# Altium schematic sheet QUTMS-ElectricalSystem.SchDoc: ####
size A0; DrawnBy: M. Broadmeadow; Organization: Queensland University of Technology; Address1: Gardens Point Campus; Address2: 2 George Street; Address3: Brisbane, QLD 4000; Address4: Australia; DocumentNumber: ####-B01; Revision: 00; SheetNumber: 1; SheetTotal: 1; Version: 00; Project: ####; PageSetup: Record=PageOptions|CenterHorizontal=True|CenterVertical=True|PrintScale=0.97|XCorrection=1.00|YCorrection=1.00|PrintKind=0|BorderSize=5000000|LeftOffset=0|BottomOffset=0|Orientation=2|PaperLength=1000|PaperWidth=1000|Scale=100|PaperSource=7|PrintQuality=-4|MediaType=1|DitherType=10|PaperKind=A4|PrintScaleMode=1
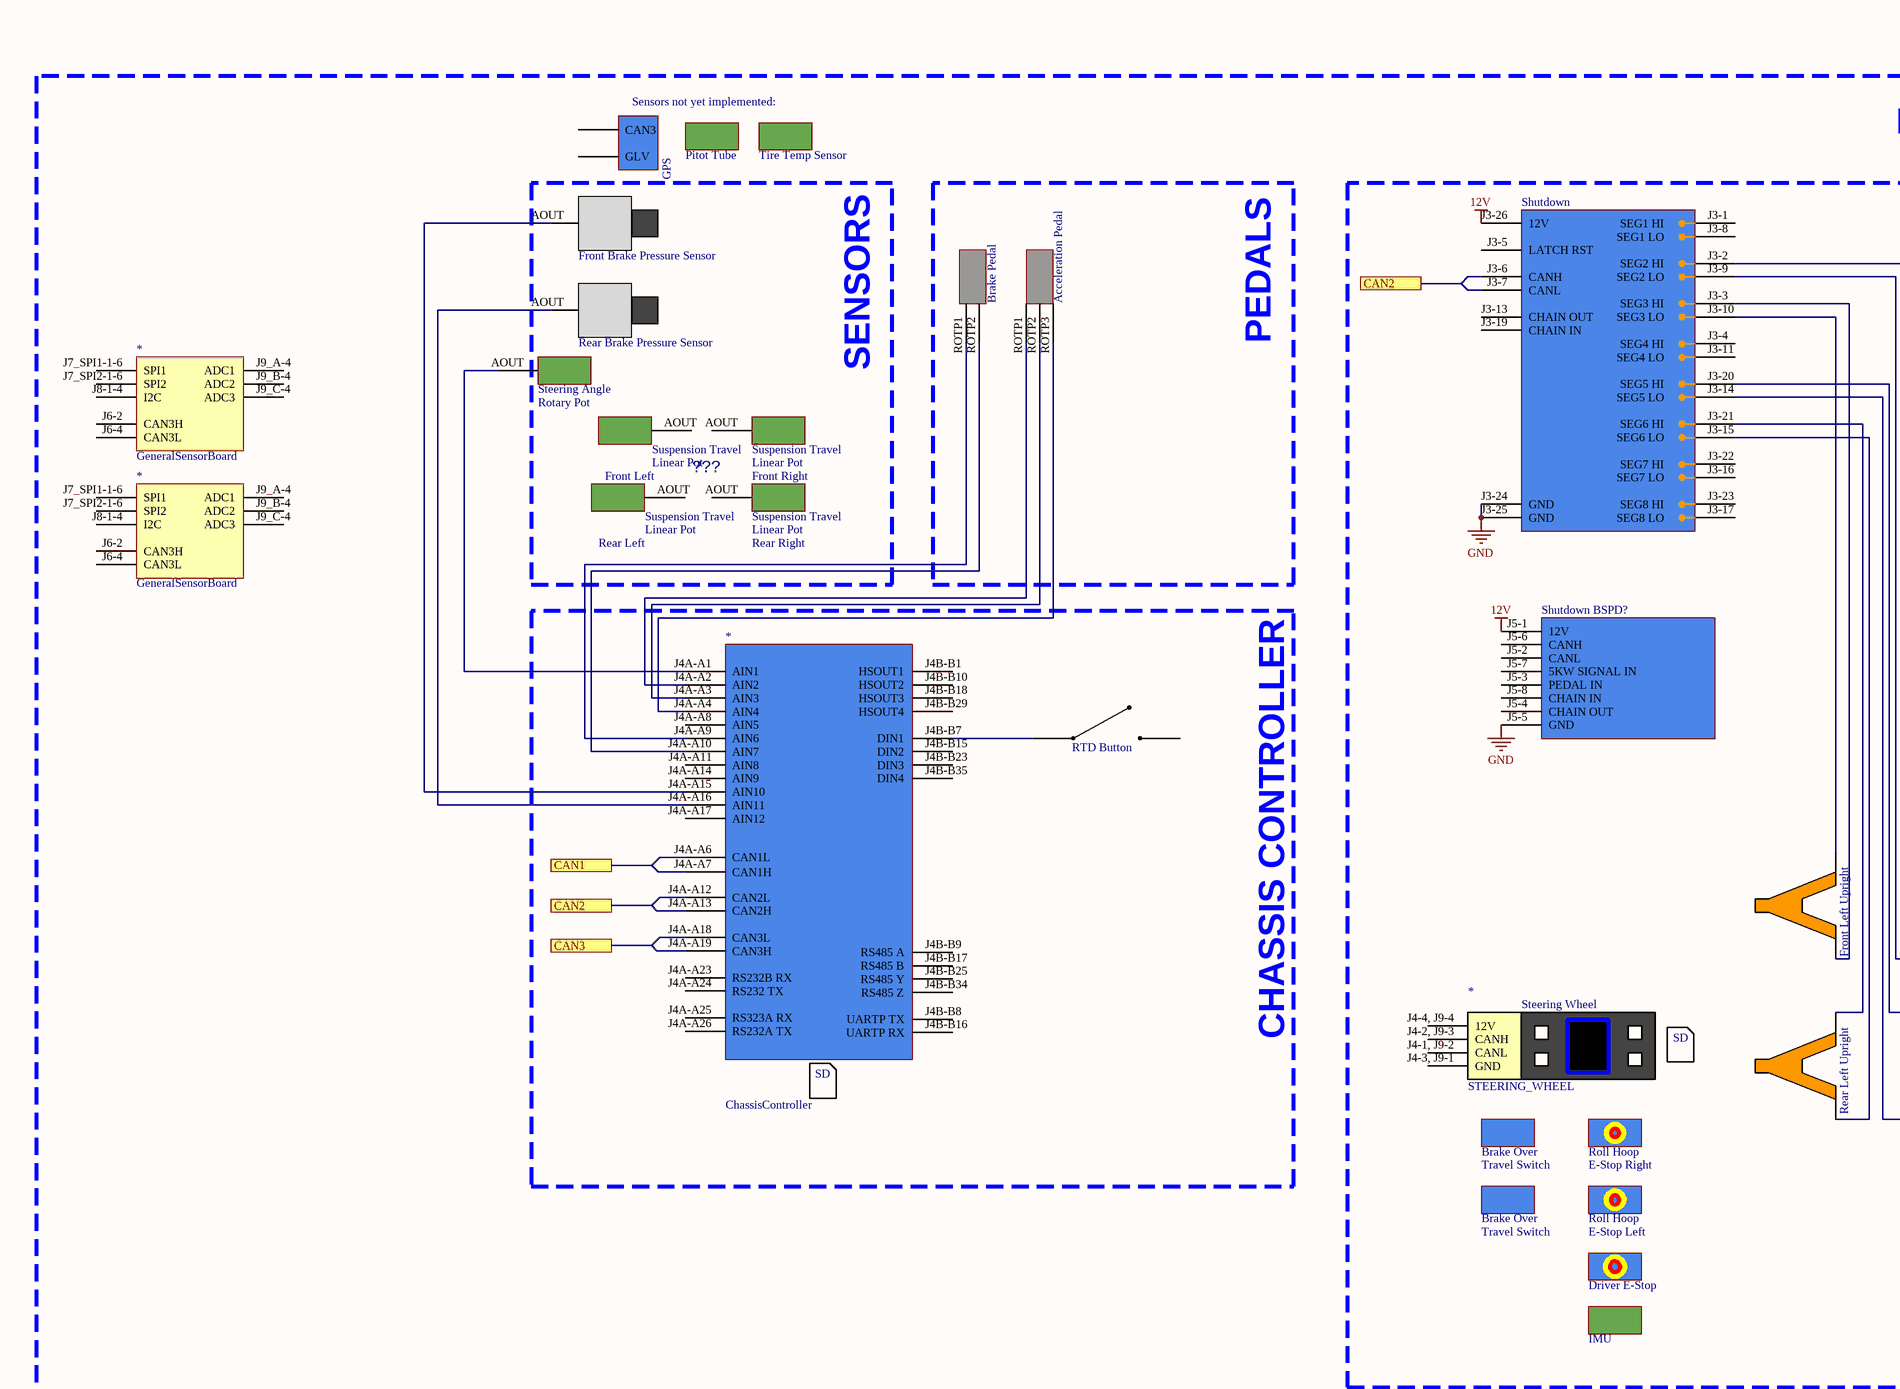
[diagram p0: QUTMS-ElectricalSystem.SchDoc, top left]
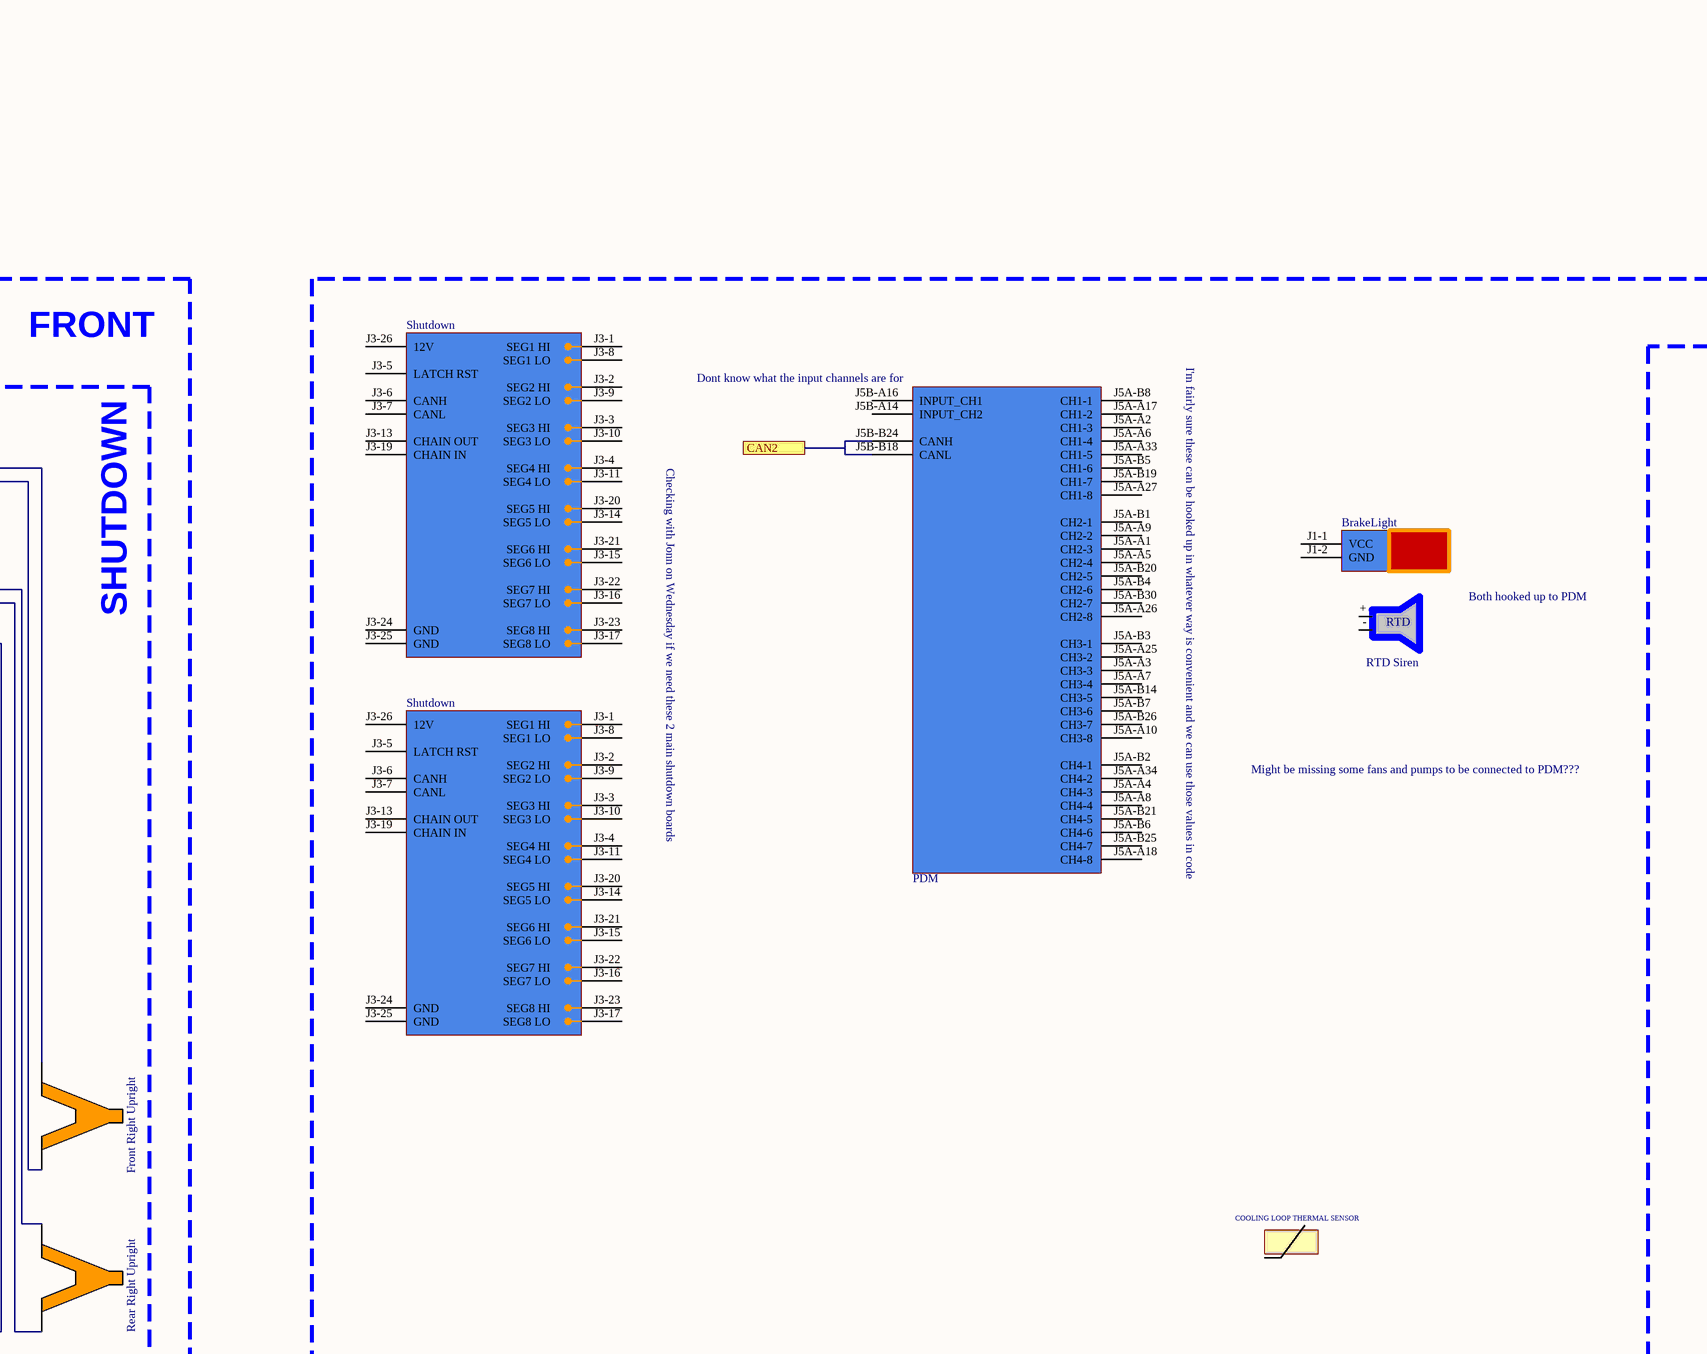
[diagram p1: QUTMS-ElectricalSystem.SchDoc, top middle]
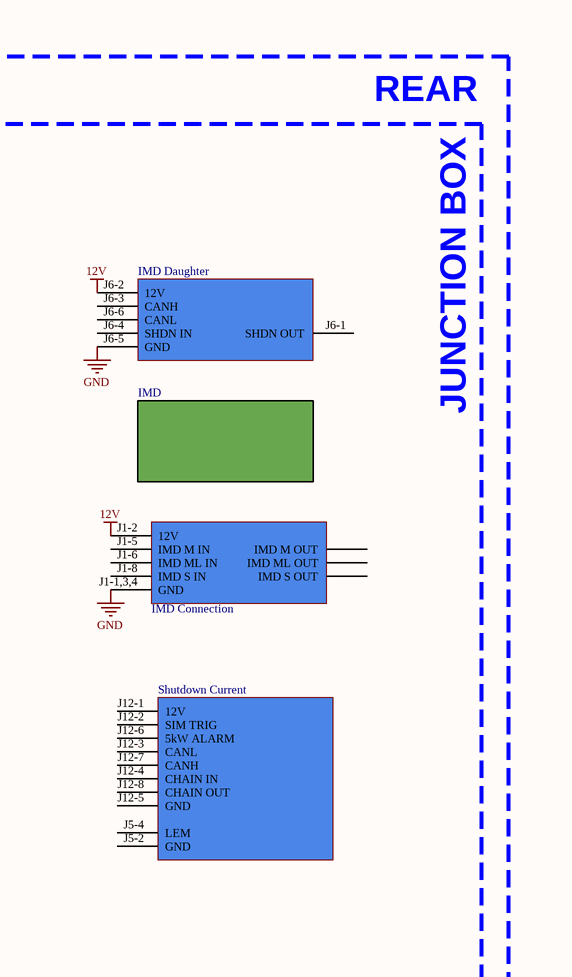
[diagram p2: QUTMS-ElectricalSystem.SchDoc, top right]
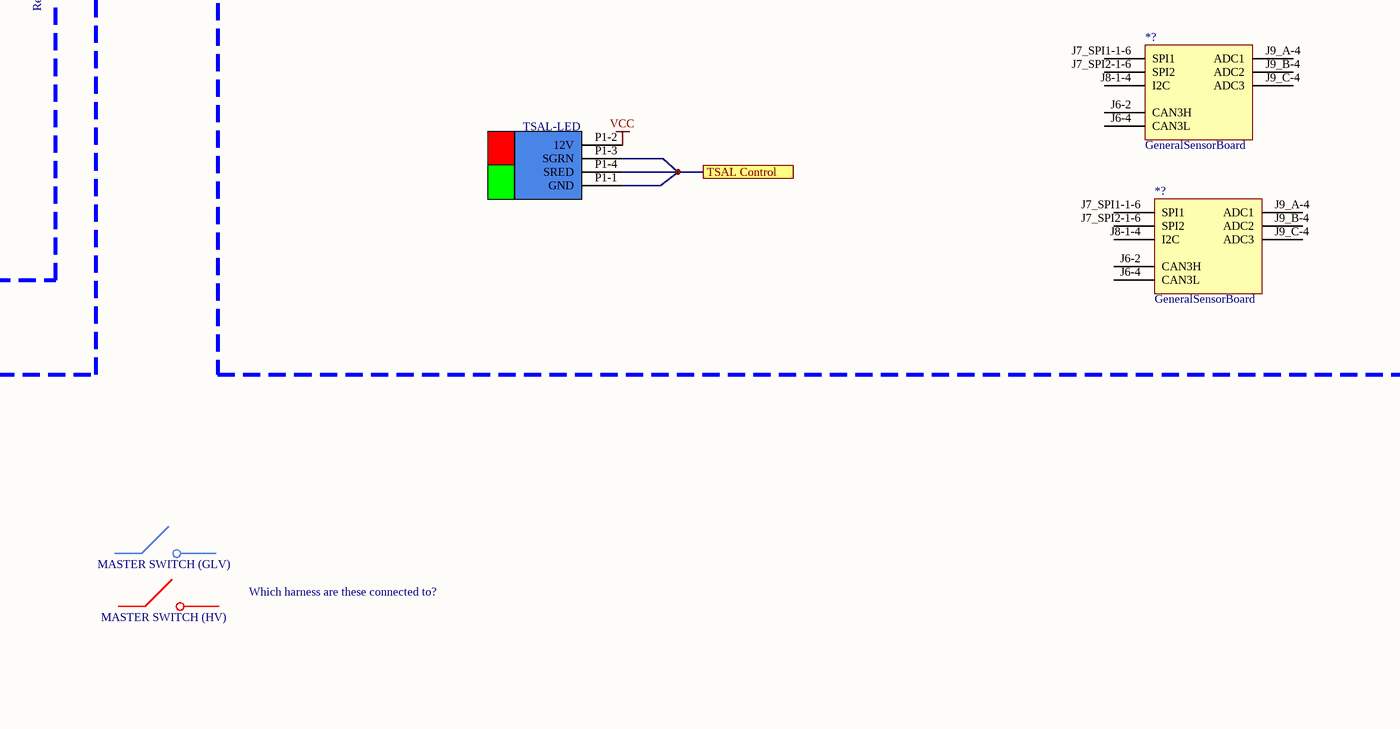
[diagram p3: QUTMS-ElectricalSystem.SchDoc, centre middle]
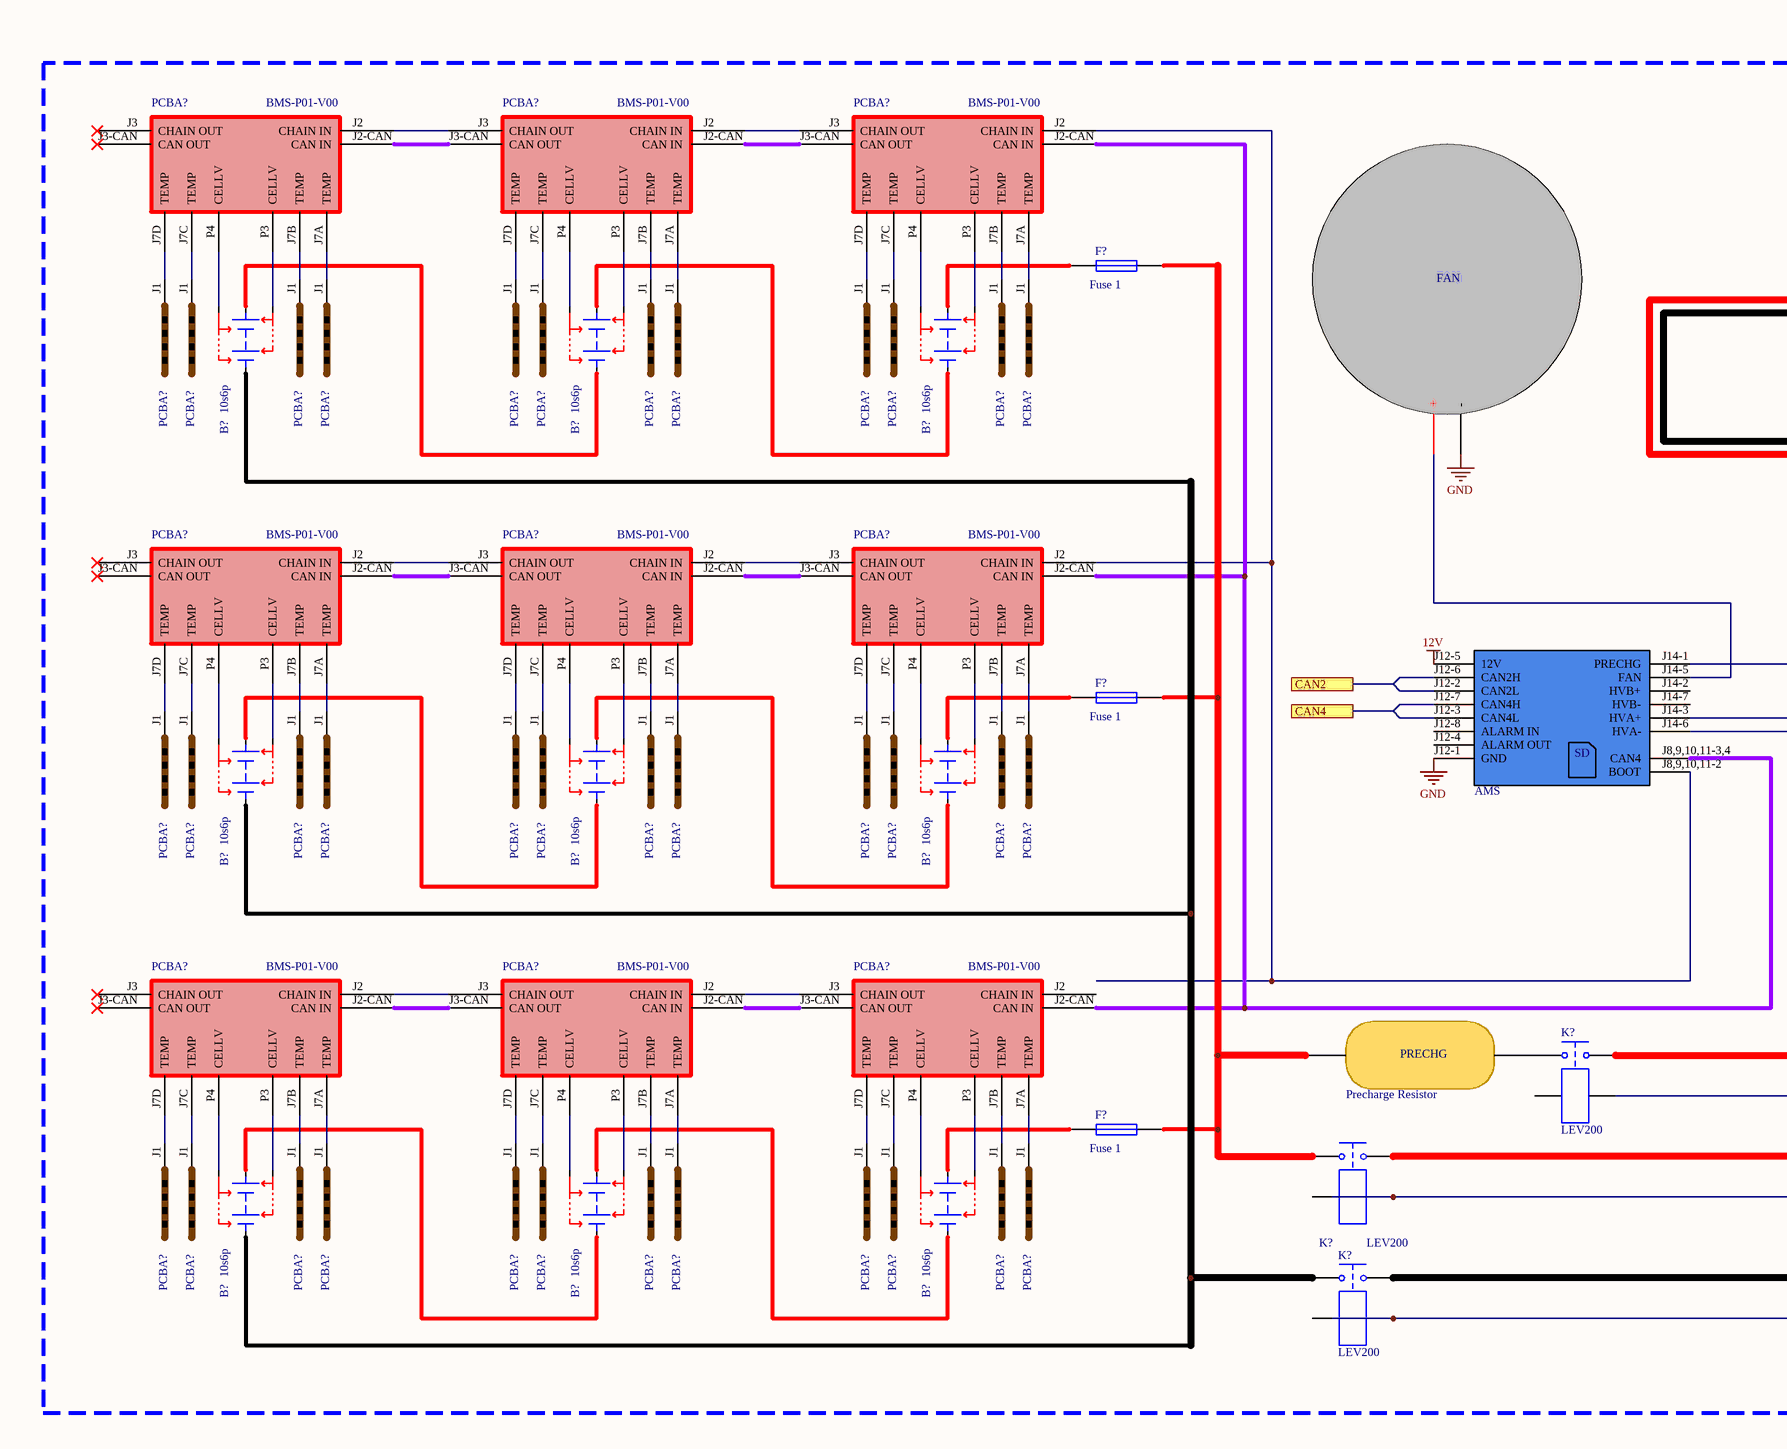
[diagram p4: QUTMS-ElectricalSystem.SchDoc, bottom middle]
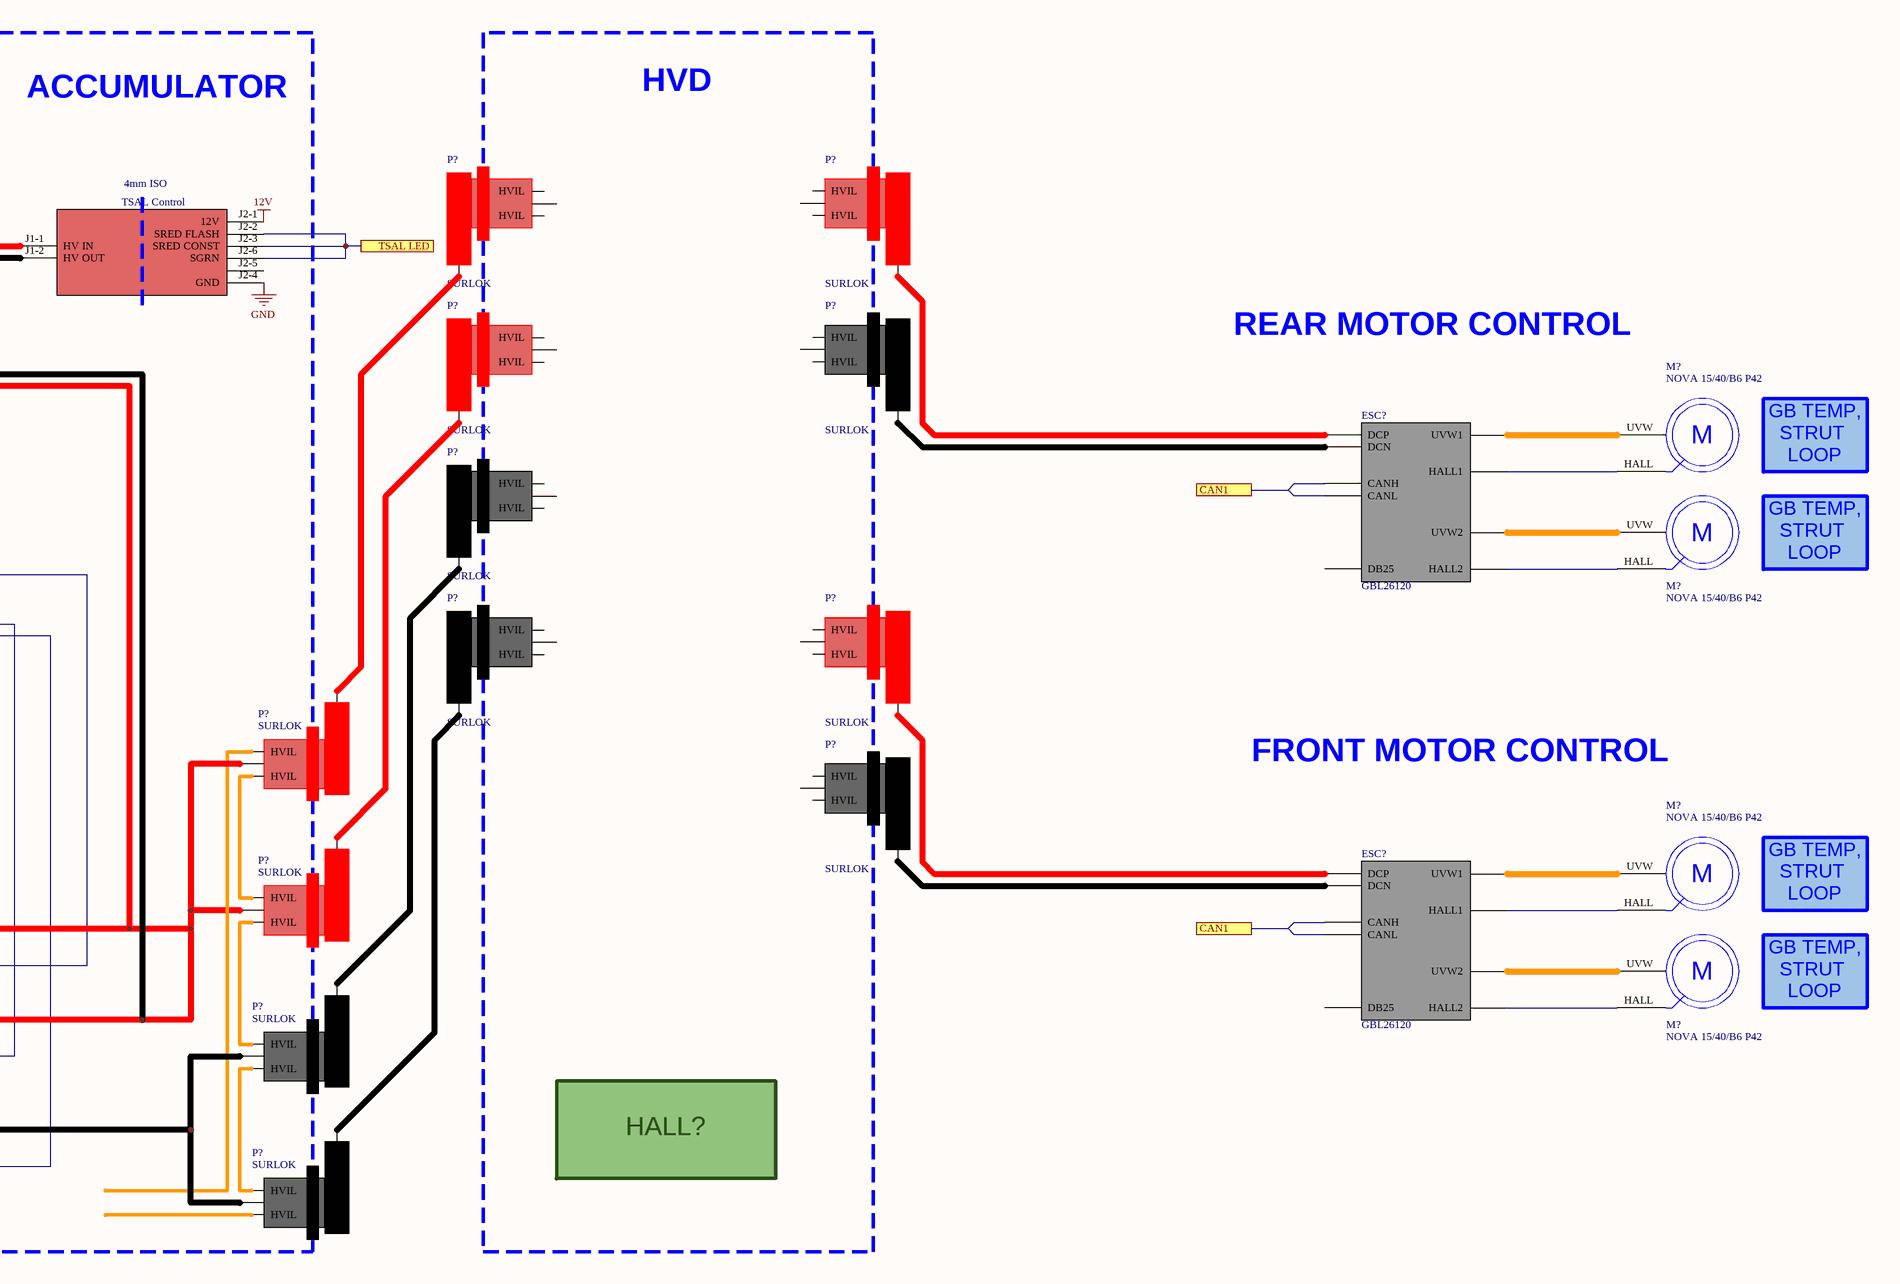
[diagram p5: QUTMS-ElectricalSystem.SchDoc, bottom right]

## Parts
(Parts that share a designator on the sheet are numbered #1, #2 ... from top to bottom, then left to right.)
*#1  Front Brake Pressure Sensor
*#2  GeneralSensorBoard
*#3  Rear Brake Pressure Sensor
*#4  GeneralSensorBoard
*#5  PDM
*#6  ChassisController
*#7  STEERING_WHEEL
*#8  RollHoopRightE-Stop  (value not drawn)
*#9  RollHoopLeftE-Stop  (value not drawn)
*#10  Driver E-Stop  (value not drawn)
*#11  Inertial Measurement Unit  (value not drawn)
*#12  Precharge Resistor
*?#1  Pitot Tube  (value not drawn)
*?#2  Tire Temperature Sensor  (value not drawn)
*?#3  GPS  (value not drawn)
*?#4  BrakePedal  (value not drawn)
*?#5  AccelerationPedal  (value not drawn)
*?#6  Steering Angle - Rotary Pot  (value not drawn)
*?#7  BrakeLight
*?#8  Front Left
*?#9  Front Right
*?#10  RTD Siren
*?#11  IMD Daughter  (value not drawn)
*?#12  Rear Left
*?#13  Rear Right
*?#14  IMD
*?#15  RTD Button
*?#16  Front Right Upright
*?#17  Front Left Upright
*?#18  Rear Right Upright
*?#19  COOLING LOOP THERMAL SENSOR  (value not drawn)
*?#20  Rear Left Upright
*?#21  BrakeOverTravelSwitch  (value not drawn)
*?#22  BrakeOverTravelSwitch  (value not drawn)
*?#23  GeneralSensorBoard
*?#24  TSAL-LED  (value not drawn)
*?#25  GeneralSensorBoard
*?#26  Master Switch (GLV)  (value not drawn)
*?#27  Master Switch HV  (value not drawn)
*?#28  TSAL_CONTROL  (value not drawn)
*?#29  AMS
?  (no value)
B?#1  10s6p
B?#2  10s6p
B?#3  10s6p
B?#4  10s6p
B?#5  10s6p
B?#6  10s6p
B?#7  10s6p
B?#8  10s6p
B?#9  10s6p
ESC?#1  GBL26120
ESC?#2  GBL26120
F?#1  Fuse 1  [PIN-W2/E2.8]
F?#2  Fuse 1  [PIN-W2/E2.8]
F?#3  Fuse 1  [PIN-W2/E2.8]
IMD_Connection?  (no value)
K?#1  LEV200
K?#2  LEV200
K?#3  LEV200
M?#1  NOVA 15/40/B6 P42
M?#2  NOVA 15/40/B6 P42
M?#3  NOVA 15/40/B6 P42
M?#4  NOVA 15/40/B6 P42
P?#1  SURLOK
P?#2  SURLOK
P?#3  SURLOK
P?#4  SURLOK
P?#5  SURLOK
P?#6  SURLOK
P?#7  SURLOK
P?#8  SURLOK
P?#9  SURLOK
P?#10  SURLOK
P?#11  SURLOK
P?#12  SURLOK
PCBA?#1  BMS-P01-V00
PCBA?#2  BMS-P01-V00
PCBA?#3  BMS-P01-V00
PCBA?#4  TEMPSTRIP-LEFT-V00  (value not drawn)
PCBA?#5  TEMPSTRIP-LEFT-V00  (value not drawn)
PCBA?#6  TEMPSTRIP-LEFT-V00  (value not drawn)
PCBA?#7  TEMPSTRIP-LEFT-V00  (value not drawn)
PCBA?#8  TEMPSTRIP-LEFT-V00  (value not drawn)
PCBA?#9  TEMPSTRIP-LEFT-V00  (value not drawn)
PCBA?#10  TEMPSTRIP-LEFT-V00  (value not drawn)
PCBA?#11  TEMPSTRIP-LEFT-V00  (value not drawn)
PCBA?#12  TEMPSTRIP-LEFT-V00  (value not drawn)
PCBA?#13  TEMPSTRIP-LEFT-V00  (value not drawn)
PCBA?#14  TEMPSTRIP-LEFT-V00  (value not drawn)
PCBA?#15  TEMPSTRIP-LEFT-V00  (value not drawn)
PCBA?#16  BMS-P01-V00
PCBA?#17  BMS-P01-V00
PCBA?#18  BMS-P01-V00
PCBA?#19  TEMPSTRIP-LEFT-V00  (value not drawn)
PCBA?#20  TEMPSTRIP-LEFT-V00  (value not drawn)
PCBA?#21  TEMPSTRIP-LEFT-V00  (value not drawn)
PCBA?#22  TEMPSTRIP-LEFT-V00  (value not drawn)
PCBA?#23  TEMPSTRIP-LEFT-V00  (value not drawn)
PCBA?#24  TEMPSTRIP-LEFT-V00  (value not drawn)
PCBA?#25  TEMPSTRIP-LEFT-V00  (value not drawn)
PCBA?#26  TEMPSTRIP-LEFT-V00  (value not drawn)
PCBA?#27  TEMPSTRIP-LEFT-V00  (value not drawn)
PCBA?#28  TEMPSTRIP-LEFT-V00  (value not drawn)
PCBA?#29  TEMPSTRIP-LEFT-V00  (value not drawn)
PCBA?#30  TEMPSTRIP-LEFT-V00  (value not drawn)
PCBA?#31  BMS-P01-V00
PCBA?#32  BMS-P01-V00
PCBA?#33  BMS-P01-V00
PCBA?#34  TEMPSTRIP-LEFT-V00  (value not drawn)
PCBA?#35  TEMPSTRIP-LEFT-V00  (value not drawn)
PCBA?#36  TEMPSTRIP-LEFT-V00  (value not drawn)
PCBA?#37  TEMPSTRIP-LEFT-V00  (value not drawn)
PCBA?#38  TEMPSTRIP-LEFT-V00  (value not drawn)
PCBA?#39  TEMPSTRIP-LEFT-V00  (value not drawn)
PCBA?#40  TEMPSTRIP-LEFT-V00  (value not drawn)
PCBA?#41  TEMPSTRIP-LEFT-V00  (value not drawn)
PCBA?#42  TEMPSTRIP-LEFT-V00  (value not drawn)
PCBA?#43  TEMPSTRIP-LEFT-V00  (value not drawn)
PCBA?#44  TEMPSTRIP-LEFT-V00  (value not drawn)
PCBA?#45  TEMPSTRIP-LEFT-V00  (value not drawn)
Shutdown#1  (no value)
Shutdown#2  (no value)
Shutdown#3  (no value)
Shutdown_BSPD?  (no value)
Shutdown_Current  (no value)

## Blocks framed on the sheet
SENSORS: *#1 *#3 *?#6 *?#8 *?#9 *?#12 *?#13
PEDALS: *?#4 *?#5
SHUTDOWN: *#7-*#11 *?#16-*?#18 *?#20-*?#22 Shutdown#2 Shutdown_BSPD?
ACCUMULATOR: *#12 *?#28 *?#29 ? B?#1-B?#9 F?#1-F?#3 K?#1-K?#3 P?#8 P?#10-P?#12 PCBA?#1-PCBA?#45
HVD: P?#1-P?#7 P?#9

## Ports
CAN1, CAN2, CAN3, CAN4, TSAL Control, TSAL LED

## Nets
12V: *?#11.J6-2(12V) *?#28.J2-1(12V) *?#29.J12-5(12V) IMD_Connection?.J1-2(12V) Shutdown#2.J3-26(12V) Shutdown_BSPD?.J5-1(12V)
GND: *?#11.J6-5(GND) *?#28.J2-4(GND) *?#29.J12-1(GND) ?.- IMD_Connection?.J1-1,3,4(GND) Shutdown#2.J3-24(GND) Shutdown#2.J3-25(GND) Shutdown_BSPD?.J5-5(GND)
VCC: *?#24.P1-2(12V)
Net*#1_AOUT: *#1.AOUT *#6.J4A-A15(AIN10)
Net*#3_AOUT: *#3.AOUT *#6.J4A-A16(AIN11)
Net*#5_J5B-B18: *#5.J5B-B18(CANL) *#5.J5B-B24(CANH)
Net*#6_J4A-A1: *#6.J4A-A1(AIN1) *?#6.AOUT
Net*#6_J4A-A2: *#6.J4A-A2(AIN2) *?#5.ROTP1
Net*#6_J4A-A3: *#6.J4A-A3(AIN3) *?#5.ROTP2
Net*#6_J4A-A4: *#6.J4A-A4(AIN4) *?#5.ROTP3
Net*#6_J4A-A6: *#6.J4A-A6(CAN1L) *#6.J4A-A7(CAN1H)
Net*#6_J4A-A9: *#6.J4A-A9(AIN6) *?#4.ROTP1
Net*#6_J4A-A10: *#6.J4A-A10(AIN7) *?#4.ROTP2
Net*#6_J4A-A12: *#6.J4A-A12(CAN2L) *#6.J4A-A13(CAN2H)
Net*#6_J4A-A18: *#6.J4A-A18(CAN3L) *#6.J4A-A19(CAN3H)
Net*#6_J4B-B7: *#6.J4B-B7(DIN1) *?#15.?1
Net*#12_?1: *#12.?1 K?#1.1
Net*#12_?2: *#12.?2 F?#1.2 F?#2.2 F?#3.2 K?#2.1
Net*?#16_I: *?#16.I Shutdown#2.J3-2(SEG2_HI)
Net*?#16_O: *?#16.O Shutdown#2.J3-9(SEG2_LO)
Net*?#17_I: *?#17.I Shutdown#2.J3-3(SEG3_HI)
Net*?#17_O: *?#17.O Shutdown#2.J3-10(SEG3_LO)
Net*?#18_I: *?#18.I Shutdown#2.J3-20(SEG5_HI)
Net*?#18_O: *?#18.O Shutdown#2.J3-14(SEG5_LO)
Net*?#20_I: *?#20.I Shutdown#2.J3-15(SEG6_LO)
Net*?#20_O: *?#20.O Shutdown#2.J3-21(SEG6_HI)
Net*?#24_P1-1: *?#24.P1-1(GND) *?#24.P1-3(SGRN) *?#24.P1-4(SRED)
Net*?#28_J1-1: *?#28.J1-1(HV_IN) *?#28.J1-2(HV_OUT) K?#1.2 K?#2.2 P?#8.1 P?#10.1
Net*?#28_J2-2: *?#28.J2-2(SRED_FLASH) *?#28.J2-3(SRED_CONST) *?#28.J2-6(SGRN)
Net*?#29_J8,9,10,11-2: *?#29.J8,9,10,11-2(BOOT) PCBA?#3.J2(CHAIN_IN) PCBA?#18.J2(CHAIN_IN)
Net*?#29_J8,9,10,11-3,4: *?#29.J8,9,10,11-3,4(CAN4) PCBA?#3.J2-CAN(CAN_IN) PCBA?#18.J2-CAN(CAN_IN) PCBA?#33.J2-CAN(CAN_IN)
Net*?#29_J12-2: *?#29.J12-2(CAN2L) *?#29.J12-6(CAN2H)
Net*?#29_J12-3: *?#29.J12-3(CAN4L) *?#29.J12-7(CAN4H)
Net*?#29_J14-1: *?#29.J14-1(PRECHG) K?#1.5
Net*?#29_J14-3: *?#29.J14-3(HVA+) K?#2.5
Net*?#29_J14-5: *?#29.J14-5(FAN) ?.+
Net*?#29_J14-6: *?#29.J14-6(HVA-) K?#3.5
NetB?#1_1: B?#1.1(+) B?#2.2(-)
NetB?#1_1: B?#1.1(+) PCBA?#1.P3(CELLV)  [a separate net that carries the same name]
NetB?#1_1: B?#1.1(+) PCBA?#1.P4(CELLV)  [a separate net that carries the same name]
NetB?#1_2: B?#1.2(-) B?#4.2(-) B?#7.2(-) K?#3.1
NetB?#2_1: B?#2.1(+) B?#3.2(-)
NetB?#2_1: B?#2.1(+) PCBA?#2.P3(CELLV)  [a separate net that carries the same name]
NetB?#2_1: B?#2.1(+) PCBA?#2.P4(CELLV)  [a separate net that carries the same name]
NetB?#3_1: B?#3.1(+) F?#1.1
NetB?#3_1: B?#3.1(+) PCBA?#3.P3(CELLV)  [a separate net that carries the same name]
NetB?#3_1: B?#3.1(+) PCBA?#3.P4(CELLV)  [a separate net that carries the same name]
NetB?#4_1: B?#4.1(+) B?#5.2(-)
NetB?#4_1: B?#4.1(+) PCBA?#16.P3(CELLV)  [a separate net that carries the same name]
NetB?#4_1: B?#4.1(+) PCBA?#16.P4(CELLV)  [a separate net that carries the same name]
NetB?#5_1: B?#5.1(+) B?#6.2(-)
NetB?#5_1: B?#5.1(+) PCBA?#17.P3(CELLV)  [a separate net that carries the same name]
NetB?#5_1: B?#5.1(+) PCBA?#17.P4(CELLV)  [a separate net that carries the same name]
NetB?#6_1: B?#6.1(+) F?#2.1
NetB?#6_1: B?#6.1(+) PCBA?#18.P3(CELLV)  [a separate net that carries the same name]
NetB?#6_1: B?#6.1(+) PCBA?#18.P4(CELLV)  [a separate net that carries the same name]
NetB?#7_1: B?#7.1(+) B?#8.2(-)
NetB?#7_1: B?#7.1(+) PCBA?#31.P3(CELLV)  [a separate net that carries the same name]
NetB?#7_1: B?#7.1(+) PCBA?#31.P4(CELLV)  [a separate net that carries the same name]
NetB?#8_1: B?#8.1(+) B?#9.2(-)
NetB?#8_1: B?#8.1(+) PCBA?#32.P3(CELLV)  [a separate net that carries the same name]
NetB?#8_1: B?#8.1(+) PCBA?#32.P4(CELLV)  [a separate net that carries the same name]
NetB?#9_1: B?#9.1(+) F?#3.1
NetB?#9_1: B?#9.1(+) PCBA?#33.P3(CELLV)  [a separate net that carries the same name]
NetB?#9_1: B?#9.1(+) PCBA?#33.P4(CELLV)  [a separate net that carries the same name]
NetESC?#1_CANH: ESC?#1.CANH ESC?#1.CANL
NetESC?#1_DCP: ESC?#1.DCP P?#2.2
NetESC?#1_DCP: ESC?#1.DCP(DCN) P?#4.2  [a separate net that carries the same name]
NetESC?#1_HALL1: ESC?#1.HALL1 M?#1.HALL
NetESC?#1_HALL2: ESC?#1.HALL2 M?#2.HALL
NetESC?#1_UVW1: ESC?#1.UVW1 M?#1.UVW(U/V/W)
NetESC?#1_UVW2: ESC?#1.UVW2 M?#2.UVW(U/V/W)
NetESC?#2_CANH: ESC?#2.CANH ESC?#2.CANL
NetESC?#2_DCP: ESC?#2.DCP P?#7.2
NetESC?#2_DCP: ESC?#2.DCP(DCN) P?#9.2  [a separate net that carries the same name]
NetESC?#2_HALL1: ESC?#2.HALL1 M?#3.HALL
NetESC?#2_HALL2: ESC?#2.HALL2 M?#4.HALL
NetESC?#2_UVW1: ESC?#2.UVW1 M?#3.UVW(U/V/W)
NetESC?#2_UVW2: ESC?#2.UVW2 M?#4.UVW(U/V/W)
NetK?#3_2: K?#3.2 P?#11.1 P?#12.1
NetP?#1_2: P?#1.2 P?#8.2
NetP?#3_2: P?#3.2 P?#10.2
NetP?#5_2: P?#5.2 P?#11.2
NetP?#6_2: P?#6.2 P?#12.2
NetP?#8_HVIL-1: P?#8.HVIL-1(HVIL) P?#10.HVIL-2(HVIL)
NetP?#10_HVIL-1: P?#10.HVIL-1(HVIL) P?#11.HVIL-2(HVIL)
NetP?#11_HVIL-1: P?#11.HVIL-1(HVIL) P?#12.HVIL-2(HVIL)
NetPCBA?#1_J2: PCBA?#1.J2(CHAIN_IN) PCBA?#2.J3(CHAIN_OUT)
NetPCBA?#1_J2-CAN: PCBA?#1.J2-CAN(CAN_IN) PCBA?#2.J3-CAN(CAN_OUT)
NetPCBA?#1_J7A: PCBA?#1.J7A(TEMP) PCBA?#7.J1(TEMP)
NetPCBA?#1_J7B: PCBA?#1.J7B(TEMP) PCBA?#6.J1(TEMP)
NetPCBA?#1_J7C: PCBA?#1.J7C(TEMP) PCBA?#5.J1(TEMP)
NetPCBA?#1_J7D: PCBA?#1.J7D(TEMP) PCBA?#4.J1(TEMP)
NetPCBA?#2_J2: PCBA?#2.J2(CHAIN_IN) PCBA?#3.J3(CHAIN_OUT)
NetPCBA?#2_J2-CAN: PCBA?#2.J2-CAN(CAN_IN) PCBA?#3.J3-CAN(CAN_OUT)
NetPCBA?#2_J7A: PCBA?#2.J7A(TEMP) PCBA?#11.J1(TEMP)
NetPCBA?#2_J7B: PCBA?#2.J7B(TEMP) PCBA?#10.J1(TEMP)
NetPCBA?#2_J7C: PCBA?#2.J7C(TEMP) PCBA?#9.J1(TEMP)
NetPCBA?#2_J7D: PCBA?#2.J7D(TEMP) PCBA?#8.J1(TEMP)
NetPCBA?#3_J7A: PCBA?#3.J7A(TEMP) PCBA?#15.J1(TEMP)
NetPCBA?#3_J7B: PCBA?#3.J7B(TEMP) PCBA?#14.J1(TEMP)
NetPCBA?#3_J7C: PCBA?#3.J7C(TEMP) PCBA?#13.J1(TEMP)
NetPCBA?#3_J7D: PCBA?#3.J7D(TEMP) PCBA?#12.J1(TEMP)
NetPCBA?#16_J2: PCBA?#16.J2(CHAIN_IN) PCBA?#17.J3(CHAIN_OUT)
NetPCBA?#16_J2-CAN: PCBA?#16.J2-CAN(CAN_IN) PCBA?#17.J3-CAN(CAN_OUT)
NetPCBA?#16_J7A: PCBA?#16.J7A(TEMP) PCBA?#22.J1(TEMP)
NetPCBA?#16_J7B: PCBA?#16.J7B(TEMP) PCBA?#21.J1(TEMP)
NetPCBA?#16_J7C: PCBA?#16.J7C(TEMP) PCBA?#20.J1(TEMP)
NetPCBA?#16_J7D: PCBA?#16.J7D(TEMP) PCBA?#19.J1(TEMP)
NetPCBA?#17_J2: PCBA?#17.J2(CHAIN_IN) PCBA?#18.J3(CHAIN_OUT)
NetPCBA?#17_J2-CAN: PCBA?#17.J2-CAN(CAN_IN) PCBA?#18.J3-CAN(CAN_OUT)
NetPCBA?#17_J7A: PCBA?#17.J7A(TEMP) PCBA?#26.J1(TEMP)
NetPCBA?#17_J7B: PCBA?#17.J7B(TEMP) PCBA?#25.J1(TEMP)
NetPCBA?#17_J7C: PCBA?#17.J7C(TEMP) PCBA?#24.J1(TEMP)
NetPCBA?#17_J7D: PCBA?#17.J7D(TEMP) PCBA?#23.J1(TEMP)
NetPCBA?#18_J7A: PCBA?#18.J7A(TEMP) PCBA?#30.J1(TEMP)
NetPCBA?#18_J7B: PCBA?#18.J7B(TEMP) PCBA?#29.J1(TEMP)
NetPCBA?#18_J7C: PCBA?#18.J7C(TEMP) PCBA?#28.J1(TEMP)
NetPCBA?#18_J7D: PCBA?#18.J7D(TEMP) PCBA?#27.J1(TEMP)
NetPCBA?#31_J2: PCBA?#31.J2(CHAIN_IN) PCBA?#32.J3(CHAIN_OUT)
NetPCBA?#31_J2-CAN: PCBA?#31.J2-CAN(CAN_IN) PCBA?#32.J3-CAN(CAN_OUT)
NetPCBA?#31_J7A: PCBA?#31.J7A(TEMP) PCBA?#37.J1(TEMP)
NetPCBA?#31_J7B: PCBA?#31.J7B(TEMP) PCBA?#36.J1(TEMP)
NetPCBA?#31_J7C: PCBA?#31.J7C(TEMP) PCBA?#35.J1(TEMP)
NetPCBA?#31_J7D: PCBA?#31.J7D(TEMP) PCBA?#34.J1(TEMP)
NetPCBA?#32_J2: PCBA?#32.J2(CHAIN_IN) PCBA?#33.J3(CHAIN_OUT)
NetPCBA?#32_J2-CAN: PCBA?#32.J2-CAN(CAN_IN) PCBA?#33.J3-CAN(CAN_OUT)
NetPCBA?#32_J7A: PCBA?#32.J7A(TEMP) PCBA?#41.J1(TEMP)
NetPCBA?#32_J7B: PCBA?#32.J7B(TEMP) PCBA?#40.J1(TEMP)
NetPCBA?#32_J7C: PCBA?#32.J7C(TEMP) PCBA?#39.J1(TEMP)
NetPCBA?#32_J7D: PCBA?#32.J7D(TEMP) PCBA?#38.J1(TEMP)
NetPCBA?#33_J7A: PCBA?#33.J7A(TEMP) PCBA?#45.J1(TEMP)
NetPCBA?#33_J7B: PCBA?#33.J7B(TEMP) PCBA?#44.J1(TEMP)
NetPCBA?#33_J7C: PCBA?#33.J7C(TEMP) PCBA?#43.J1(TEMP)
NetPCBA?#33_J7D: PCBA?#33.J7D(TEMP) PCBA?#42.J1(TEMP)
NetShutdown#2_J3-6: Shutdown#2.J3-6(CANH) Shutdown#2.J3-7(CANL)

Not connected (* = marked no-connect by the designer): *#2 J6-2(CAN3H) J6-4(CAN3L) J7_SPI1-1-6(SPI1) J7_SPI2-1-6(SPI2) J8-1-4(I2C) J9_A-4(ADC1) J9_B-4(ADC2) J9_C-4(ADC3); *#4 J6-2(CAN3H) J6-4(CAN3L) J7_SPI1-1-6(SPI1) J7_SPI2-1-6(SPI2) J8-1-4(I2C) J9_A-4(ADC1) J9_B-4(ADC2) J9_C-4(ADC3); *#5 J5A-A1(CH2-3) J5A-A2(CH1-3) J5A-A3(CH3-3) J5A-A4(CH4-3) J5A-A5(CH2-4) J5A-A6(CH1-4) J5A-A7(CH3-4) J5A-A8(CH4-4) J5A-A9(CH2-2) J5A-A10(CH3-8) J5A-A17(CH1-2) J5A-A18(CH4-8) J5A-A25(CH3-2) J5A-A26(CH2-8) J5A-A27(CH1-8) J5A-A33(CH1-5) J5A-A34(CH4-2) J5A-B1(CH2-1) J5A-B2(CH4-1) J5A-B3(CH3-1) J5A-B4(CH2-6) J5A-B5(CH1-6) J5A-B6(CH4-6) J5A-B7(CH3-6) J5A-B8(CH1-1) J5A-B14(CH3-5) J5A-B19(CH1-7) J5A-B20(CH2-5) J5A-B21(CH4-5) J5A-B25(CH4-7) J5A-B26(CH3-7) J5A-B30(CH2-7) J5B-A14(INPUT_CH2) J5B-A16(INPUT_CH1); *#6 J4A-A8(AIN5) J4A-A11(AIN8) J4A-A14(AIN9) J4A-A17(AIN12) J4A-A23(RS232B_RX) J4A-A24(RS232_TX) J4A-A25(RS323A_RX) J4A-A26(RS232A_TX) J4B-B1(HSOUT1) J4B-B8(UARTP_TX) J4B-B9(RS485_A) J4B-B10(HSOUT2) J4B-B15(DIN2) J4B-B16(UARTP_RX) J4B-B17(RS485_B) J4B-B18(HSOUT3) J4B-B23(DIN3) J4B-B25(RS485_Y) J4B-B29(HSOUT4) J4B-B34(RS485_Z) J4B-B35(DIN4); *#7 J4-1, J9-2(CANL) J4-2, J9-3(CANH) J4-3, J9-1(GND) J4-4, J9-4(12V); *?#3 ?1(CAN3) ?2(GLV); *?#7 J1-1(VCC) J1-2(GND); *?#8 AOUT; *?#9 AOUT; *?#10 + -; *?#11 J6-1(SHDN_OUT) J6-3(CANH) J6-4(SHDN_IN) J6-6(CANL); *?#12 AOUT; *?#13 AOUT; *?#15 ?2; *?#23 J6-2(CAN3H) J6-4(CAN3L) J7_SPI1-1-6(SPI1) J7_SPI2-1-6(SPI2) J8-1-4(I2C) J9_A-4(ADC1) J9_B-4(ADC2) J9_C-4(ADC3); *?#25 J6-2(CAN3H) J6-4(CAN3L) J7_SPI1-1-6(SPI1) J7_SPI2-1-6(SPI2) J8-1-4(I2C) J9_A-4(ADC1) J9_B-4(ADC2) J9_C-4(ADC3); *?#28 J2-5; *?#29 J12-4(ALARM_OUT) J12-8(ALARM_IN) J14-2(HVB+) J14-7(HVB-); ESC?#1 DB25; ESC?#2 DB25; IMD_Connection? ?1(IMD_ML_OUT) ?2(IMD_S_OUT) ?3(IMD_M_OUT) J1-5(IMD_M_IN) J1-6(IMD_ML_IN) J1-8(IMD_S_IN); K?#1 4; K?#2 4; K?#3 4; P?#1 1 HVIL-1(HVIL) HVIL-2(HVIL); P?#2 1 HVIL-1(HVIL) HVIL-2(HVIL); P?#3 1 HVIL-1(HVIL) HVIL-2(HVIL); P?#4 1 HVIL-1(HVIL) HVIL-2(HVIL); P?#5 1 HVIL-1(HVIL) HVIL-2(HVIL); P?#6 1 HVIL-1(HVIL) HVIL-2(HVIL); P?#7 1 HVIL-1(HVIL) HVIL-2(HVIL); P?#8 HVIL-2(HVIL); P?#9 1 HVIL-1(HVIL) HVIL-2(HVIL); P?#12 HVIL-1(HVIL); PCBA?#1 J3(CHAIN_OUT)* J3-CAN(CAN_OUT)*; PCBA?#16 J3(CHAIN_OUT)* J3-CAN(CAN_OUT)*; PCBA?#31 J3(CHAIN_OUT)* J3-CAN(CAN_OUT)*; PCBA?#33 J2(CHAIN_IN); Shutdown#1 J3-1(SEG1_HI) J3-2(SEG2_HI) J3-3(SEG3_HI) J3-4(SEG4_HI) J3-5(LATCH_RST) J3-6(CANH) J3-7(CANL) J3-8(SEG1_LO) J3-9(SEG2_LO) J3-10(SEG3_LO) J3-11(SEG4_LO) J3-13(CHAIN_OUT) J3-14(SEG5_LO) J3-15(SEG6_LO) J3-16(SEG7_LO) J3-17(SEG8_LO) J3-19(CHAIN_IN) J3-20(SEG5_HI) J3-21(SEG6_HI) J3-22(SEG7_HI) J3-23(SEG8_HI) J3-24(GND) J3-25(GND) J3-26(12V); Shutdown#2 J3-1(SEG1_HI) J3-4(SEG4_HI) J3-5(LATCH_RST) J3-8(SEG1_LO) J3-11(SEG4_LO) J3-13(CHAIN_OUT) J3-16(SEG7_LO) J3-17(SEG8_LO) J3-19(CHAIN_IN) J3-22(SEG7_HI) J3-23(SEG8_HI); Shutdown#3 J3-1(SEG1_HI) J3-2(SEG2_HI) J3-3(SEG3_HI) J3-4(SEG4_HI) J3-5(LATCH_RST) J3-6(CANH) J3-7(CANL) J3-8(SEG1_LO) J3-9(SEG2_LO) J3-10(SEG3_LO) J3-11(SEG4_LO) J3-13(CHAIN_OUT) J3-14(SEG5_LO) J3-15(SEG6_LO) J3-16(SEG7_LO) J3-17(SEG8_LO) J3-19(CHAIN_IN) J3-20(SEG5_HI) J3-21(SEG6_HI) J3-22(SEG7_HI) J3-23(SEG8_HI) J3-24(GND) J3-25(GND) J3-26(12V); Shutdown_BSPD? J5-2(CANL) J5-3(PEDAL_IN) J5-4(CHAIN_OUT) J5-6(CANH) J5-7(5KW_SIGNAL_IN) J5-8(CHAIN_IN); Shutdown_Current J5-2(GND) J5-4(LEM) J12-1(12V) J12-2(SIM_TRIG) J12-3(CANL) J12-4(CHAIN_IN) J12-5(GND) J12-6(5kW_ALARM) J12-7(CANH) J12-8(CHAIN_OUT)

## Notes on the sheet
- (near *?#1) Sensors not yet implemented:
- FRONT
- REAR
- (near *#5) Dont know what the input channels are for
- I'm fairly sure these can be hooked up in whatever way is convenient and we can use those values in code
- Checking with Jonn on Wednesday if we need these 2 main shutdown boards
- Both hooked up to PDM
- (near *?#13) ???
- JUNCTION BOX
- Might be missing some fans and pumps to be connected to PDM???
- CHASSIS CONTROLLER
- Which harness are these connected to?
- REAR MOTOR CONTROL
- GB TEMP,
  STRUT
  LOOP
- FRONT MOTOR CONTROL
- HALL?
- Title
- Size:
- Date:
- File:
- A0
- Number:
- Time:
- Revision:
- Sheet
- of
- (in symbol AccelerationPedal) Acceleration Pedal
- (in symbol AMS) SD
- (in symbol BrakeOverTravelSwitch) Brake Over; Travel Switch
- (in symbol BrakePedal) Brake Pedal
- (in symbol ChassisController) SD
- (in symbol IMD_CONNECTION) IMD Connection
- (in symbol Inertial Measurement Unit) IMU
- (in symbol Master Switch (GLV)) MASTER SWITCH (GLV)
- (in symbol Master Switch HV) MASTER SWITCH (HV)
- (in symbol NOVA15) M
- (in symbol Precharge Resistor) PRECHG
- (in symbol RollHoopLeftE-Stop) Roll Hoop; E-Stop Left
- (in symbol RollHoopRightE-Stop) Roll Hoop; E-Stop Right
- (in symbol RTD Siren) RTD
- (in symbol Steering Angle - Rotary Pot) Steering Angle; Rotary Pot
- (in symbol STEERING_WHEEL) Steering Wheel; SD
- (in symbol Suspension Travel - Linear Pot) Suspension Travel; Linear Pot
- (in symbol Tire Temperature Sensor) Tire Temp Sensor
- (in symbol TSAL_CONTROL) 4mm ISO; TSAL Control

## Library data of the parts
*#1 *#3 = Brake Pressure Sensor
*?#8 *?#9 *?#12 *?#13 = Suspension Travel - Linear Pot
*?#16-*?#18 *?#20 = Upright
? = FAN
B?#1-B?#9 = Battery: Battery module, 10s6p
F?#1-F?#3 = Fuse 1: Fuse; Published: 8-Jun-2000; LatestRevisionDate: 17-Jul-2002; LatestRevisionNote: Re-released for DXP Platform.; PackageReference: PIN-W2/E2.8; Publisher: Altium Limited; PackageDescription: Thru-Hole; 2 Leads
IMD_Connection? = IMD_CONNECTION
M?#1-M?#4 = NOVA15
P?#1-P?#3 P?#7 P?#8 P?#10 = SURLOK-EMI-RED
P?#4-P?#6 P?#9 P?#11 P?#12 = SURLOK-EMI-BLACK
Shutdown#1-Shutdown#3 = SHDN
Shutdown_BSPD? = SHDN_BSPD
Shutdown_Current = SHDN Current